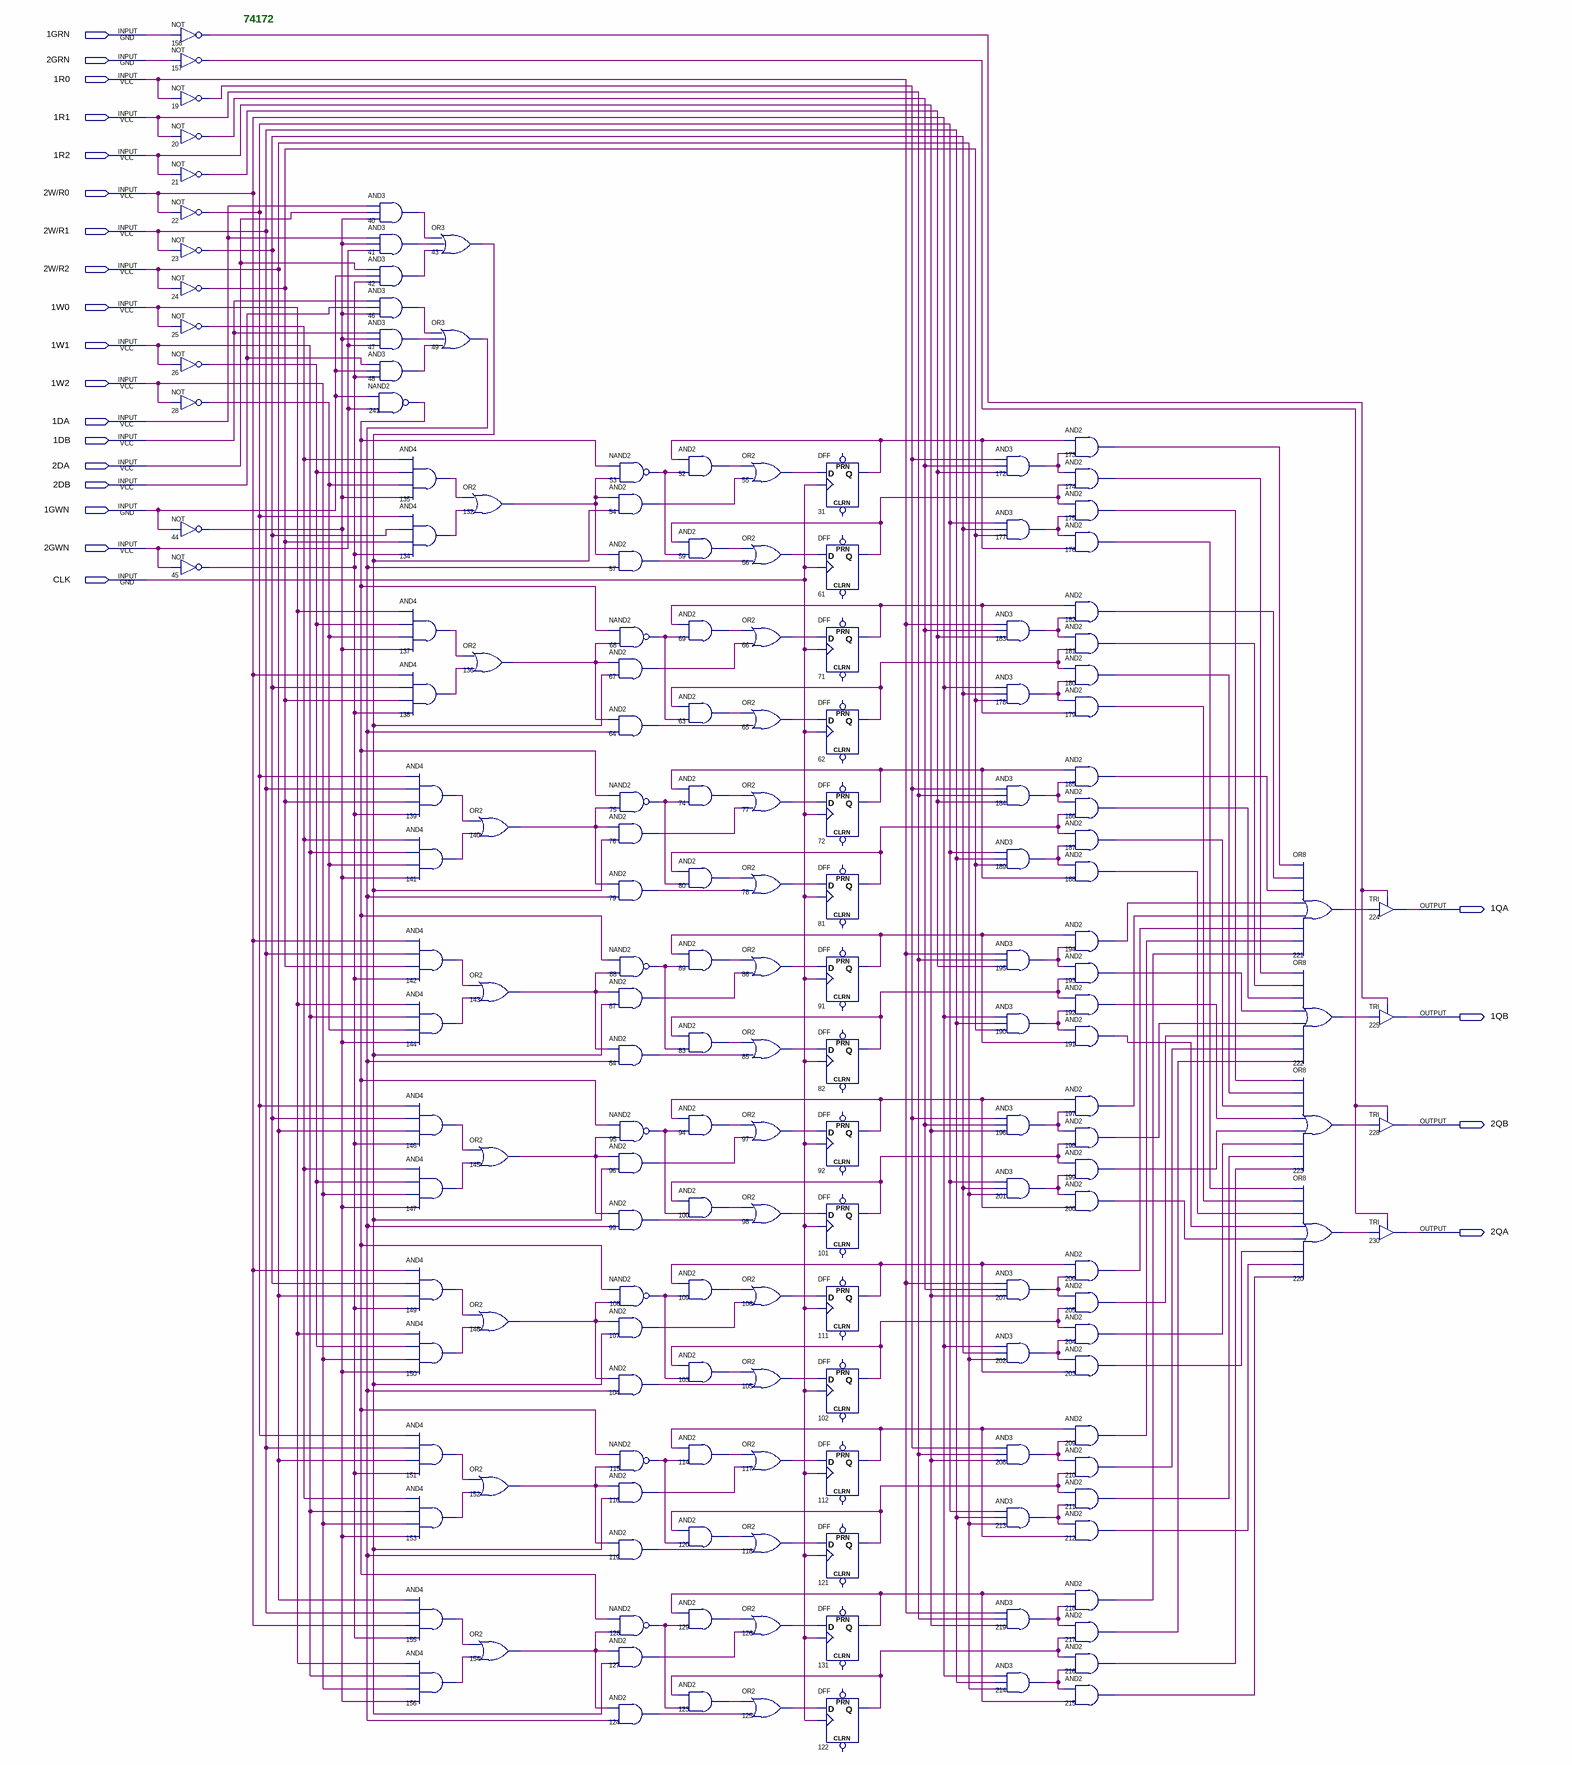
[diagram p0: schematic sheet]
// Quartus schematic 74172.bdf as structural Verilog: 174 symbols, 22 pins
module \74172  (
  input  \1GRN ,
  input  \2GRN ,
  input  \1R0 ,
  input  \1R1 ,
  input  \1R2 ,
  input  \2W/R0 ,
  input  \2W/R1 ,
  input  \2W/R2 ,
  input  \1W0 ,
  input  \1W1 ,
  input  \1W2 ,
  input  \1DA ,
  input  \1DB ,
  input  \2DA ,
  input  \2DB ,
  input  \1GWN ,
  input  \2GWN ,
  input  CLK,
  output \1QA ,
  output \1QB ,
  output \2QB ,
  output \2QA 
);

  wire n19_out, n20_out, n21_out, n22_out, n23_out, n24_out, n25_out, n26_out, n28_out, n31_q, n40_out,
       n41_out, n42_out, n43_out, n44_out, n45_out, n46_out, n47_out, n48_out, n49_out, n52_out, n53_out,
       n54_out, n55_out, n56_out, n57_out, n59_out, n61_q, n62_q, n63_out, n64_out, n65_out, n66_out,
       n67_out, n68_out, n69_out, n71_q, n72_q, n74_out, n75_out, n76_out, n77_out, n78_out, n79_out,
       n80_out, n81_q, n82_q, n83_out, n84_out, n85_out, n86_out, n87_out, n88_out, n89_out, n91_q, n92_q,
       n94_out, n95_out, n96_out, n97_out, n98_out, n99_out, n100_out, n101_q, n102_q, n103_out, n104_out,
       n105_out, n106_out, n107_out, n108_out, n109_out, n111_q, n112_q, n114_out, n115_out, n116_out,
       n117_out, n118_out, n119_out, n120_out, n121_q, n122_q, n123_out, n124_out, n125_out, n126_out,
       n127_out, n128_out, n129_out, n131_q, n132_out, n134_out, n135_out, n136_out, n137_out, n138_out,
       n139_out, n140_out, n141_out, n142_out, n143_out, n144_out, n145_out, n146_out, n147_out, n148_out,
       n149_out, n150_out, n151_out, n152_out, n153_out, n154_out, n155_out, n156_out, n157_out, n158_out,
       n172_out, n173_out, n174_out, n175_out, n176_out, n177_out, n178_out, n179_out, n180_out, n181_out,
       n182_out, n183_out, n184_out, n185_out, n186_out, n187_out, n188_out, n189_out, n190_out, n191_out,
       n192_out, n193_out, n194_out, n195_out, n196_out, n197_out, n198_out, n199_out, n200_out, n201_out,
       n202_out, n203_out, n204_out, n205_out, n206_out, n207_out, n208_out, n209_out, n210_out, n211_out,
       n212_out, n213_out, n214_out, n215_out, n216_out, n217_out, n218_out, n219_out, n220_out, n221_out,
       n222_out, n223_out, n241_out;

  not u_158 (n158_out, \1GRN );
  not u_157 (n157_out, \2GRN );
  not u_19 (n19_out, \1R0 );
  not u_20 (n20_out, \1R1 );
  not u_21 (n21_out, \1R2 );
  not u_22 (n22_out, \2W/R0 );
  not u_23 (n23_out, \2W/R1 );
  not u_24 (n24_out, \2W/R2 );
  not u_25 (n25_out, \1W0 );
  not u_26 (n26_out, \1W1 );
  not u_28 (n28_out, \1W2 );
  not u_44 (n44_out, \1GWN );
  not u_45 (n45_out, \2GWN );
  and u_40 (n40_out, \1DA , \2DA , n44_out);
  and u_41 (n41_out, \1DA , n44_out, \2GWN );
  and u_42 (n42_out, \2DA , \1GWN , n45_out);
  and u_46 (n46_out, \1DB , \2DB , n44_out);
  and u_47 (n47_out, \1DB , n44_out, \2GWN );
  and u_48 (n48_out, \2DB , \1GWN , n45_out);
  nand u_241 (n241_out, \1GWN , \2GWN );
  and u_135 (n135_out, n25_out, n26_out, n28_out, n44_out);
  and u_134 (n134_out, n22_out, n23_out, n24_out, n45_out);
  and u_137 (n137_out, \1W0 , n26_out, n28_out, n44_out);
  and u_138 (n138_out, \2W/R0 , n23_out, n24_out, n45_out);
  and u_139 (n139_out, n22_out, \2W/R1 , n24_out, n45_out);
  and u_141 (n141_out, n25_out, \1W1 , n28_out, n44_out);
  and u_142 (n142_out, \2W/R0 , \2W/R1 , n24_out, n45_out);
  and u_144 (n144_out, \1W0 , \1W1 , n28_out, n44_out);
  and u_146 (n146_out, n22_out, n23_out, \2W/R2 , n45_out);
  and u_147 (n147_out, n25_out, n26_out, \1W2 , n44_out);
  and u_149 (n149_out, \2W/R0 , n23_out, \2W/R2 , n45_out);
  and u_150 (n150_out, \1W0 , n26_out, \1W2 , n44_out);
  and u_151 (n151_out, n22_out, \2W/R1 , \2W/R2 , n45_out);
  and u_153 (n153_out, n25_out, \1W1 , \1W2 , n44_out);
  and u_155 (n155_out, \2W/R2 , \2W/R1 , \2W/R0 , n45_out);
  and u_156 (n156_out, \1W0 , \1W1 , \1W2 , n44_out);
  or u_43 (n43_out, n40_out, n41_out, n42_out);
  or u_49 (n49_out, n46_out, n47_out, n48_out);
  or u_132 (n132_out, n135_out, n134_out);
  or u_136 (n136_out, n137_out, n138_out);
  or u_140 (n140_out, n139_out, n141_out);
  or u_143 (n143_out, n142_out, n144_out);
  or u_145 (n145_out, n146_out, n147_out);
  or u_148 (n148_out, n149_out, n150_out);
  or u_152 (n152_out, n151_out, n153_out);
  or u_154 (n154_out, n155_out, n156_out);
  nand u_53 (n53_out, n241_out, n132_out);
  and u_54 (n54_out, n132_out, n43_out);
  and u_57 (n57_out, n132_out, n49_out);
  nand u_68 (n68_out, n241_out, n136_out);
  and u_67 (n67_out, n136_out, n43_out);
  and u_64 (n64_out, n136_out, n49_out);
  nand u_75 (n75_out, n241_out, n140_out);
  and u_76 (n76_out, n140_out, n43_out);
  and u_79 (n79_out, n140_out, n49_out);
  nand u_88 (n88_out, n241_out, n143_out);
  and u_87 (n87_out, n143_out, n43_out);
  and u_84 (n84_out, n143_out, n49_out);
  nand u_95 (n95_out, n241_out, n145_out);
  and u_96 (n96_out, n145_out, n43_out);
  and u_99 (n99_out, n145_out, n49_out);
  nand u_108 (n108_out, n241_out, n148_out);
  and u_107 (n107_out, n148_out, n43_out);
  and u_104 (n104_out, n148_out, n49_out);
  nand u_115 (n115_out, n241_out, n152_out);
  and u_116 (n116_out, n152_out, n43_out);
  and u_119 (n119_out, n152_out, n49_out);
  nand u_128 (n128_out, n241_out, n154_out);
  and u_127 (n127_out, n154_out, n43_out);
  and u_124 (n124_out, n154_out, n49_out);
  and u_52 (n52_out, n31_q, n53_out);
  and u_59 (n59_out, n61_q, n53_out);
  and u_69 (n69_out, n71_q, n68_out);
  and u_63 (n63_out, n62_q, n68_out);
  and u_74 (n74_out, n72_q, n75_out);
  and u_80 (n80_out, n81_q, n75_out);
  and u_89 (n89_out, n91_q, n88_out);
  and u_83 (n83_out, n82_q, n88_out);
  and u_94 (n94_out, n92_q, n95_out);
  and u_100 (n100_out, n101_q, n95_out);
  and u_109 (n109_out, n111_q, n108_out);
  and u_103 (n103_out, n102_q, n108_out);
  and u_114 (n114_out, n112_q, n115_out);
  and u_120 (n120_out, n121_q, n115_out);
  and u_129 (n129_out, n131_q, n128_out);
  and u_123 (n123_out, n122_q, n128_out);
  or u_55 (n55_out, n52_out, n54_out);
  or u_56 (n56_out, n59_out, n57_out);
  or u_66 (n66_out, n69_out, n67_out);
  or u_65 (n65_out, n63_out, n64_out);
  or u_77 (n77_out, n74_out, n76_out);
  or u_78 (n78_out, n80_out, n79_out);
  or u_86 (n86_out, n89_out, n87_out);
  or u_85 (n85_out, n83_out, n84_out);
  or u_97 (n97_out, n94_out, n96_out);
  or u_98 (n98_out, n100_out, n99_out);
  or u_106 (n106_out, n109_out, n107_out);
  or u_105 (n105_out, n103_out, n104_out);
  or u_117 (n117_out, n114_out, n116_out);
  or u_118 (n118_out, n120_out, n119_out);
  or u_126 (n126_out, n129_out, n127_out);
  or u_125 (n125_out, n123_out, n124_out);
  DFF u_31 (.CLK(CLK), .D(n55_out), .Q(n31_q));  // open: CLRN, PRN
  DFF u_61 (.CLK(CLK), .D(n56_out), .Q(n61_q));  // open: CLRN, PRN
  DFF u_71 (.CLK(CLK), .D(n66_out), .Q(n71_q));  // open: CLRN, PRN
  DFF u_62 (.CLK(CLK), .D(n65_out), .Q(n62_q));  // open: CLRN, PRN
  DFF u_72 (.CLK(CLK), .D(n77_out), .Q(n72_q));  // open: CLRN, PRN
  DFF u_81 (.CLK(CLK), .D(n78_out), .Q(n81_q));  // open: CLRN, PRN
  DFF u_91 (.CLK(CLK), .D(n86_out), .Q(n91_q));  // open: CLRN, PRN
  DFF u_82 (.CLK(CLK), .D(n85_out), .Q(n82_q));  // open: CLRN, PRN
  DFF u_92 (.CLK(CLK), .D(n97_out), .Q(n92_q));  // open: CLRN, PRN
  DFF u_101 (.CLK(CLK), .D(n98_out), .Q(n101_q));  // open: CLRN, PRN
  DFF u_111 (.CLK(CLK), .D(n106_out), .Q(n111_q));  // open: CLRN, PRN
  DFF u_102 (.CLK(CLK), .D(n105_out), .Q(n102_q));  // open: CLRN, PRN
  DFF u_112 (.CLK(CLK), .D(n117_out), .Q(n112_q));  // open: CLRN, PRN
  DFF u_121 (.CLK(CLK), .D(n118_out), .Q(n121_q));  // open: CLRN, PRN
  DFF u_131 (.CLK(CLK), .D(n126_out), .Q(n131_q));  // open: CLRN, PRN
  DFF u_122 (.CLK(CLK), .D(n125_out), .Q(n122_q));  // open: CLRN, PRN
  and u_172 (n172_out, n19_out, n20_out, n21_out);
  and u_177 (n177_out, n22_out, n23_out, n24_out);
  and u_183 (n183_out, \1R0 , n20_out, n21_out);
  and u_178 (n178_out, \2W/R0 , n23_out, n24_out);
  and u_184 (n184_out, n19_out, \1R1 , n21_out);
  and u_189 (n189_out, n22_out, \2W/R1 , n24_out);
  and u_195 (n195_out, \1R0 , \1R1 , n21_out);
  and u_190 (n190_out, \2W/R0 , \2W/R1 , n24_out);
  and u_196 (n196_out, n19_out, n20_out, \1R2 );
  and u_201 (n201_out, n22_out, n23_out, \2W/R2 );
  and u_207 (n207_out, \1R0 , n20_out, \1R2 );
  and u_202 (n202_out, \2W/R0 , n23_out, \2W/R2 );
  and u_208 (n208_out, n19_out, \1R1 , \1R2 );
  and u_213 (n213_out, n22_out, \2W/R1 , \2W/R2 );
  and u_219 (n219_out, \1R0 , \1R1 , \1R2 );
  and u_214 (n214_out, \2W/R0 , \2W/R1 , \2W/R2 );
  and u_173 (n173_out, n31_q, n172_out);
  and u_174 (n174_out, n172_out, n61_q);
  and u_175 (n175_out, n61_q, n177_out);
  and u_176 (n176_out, n177_out, n31_q);
  and u_182 (n182_out, n71_q, n183_out);
  and u_181 (n181_out, n183_out, n62_q);
  and u_180 (n180_out, n62_q, n178_out);
  and u_179 (n179_out, n178_out, n71_q);
  and u_185 (n185_out, n72_q, n184_out);
  and u_186 (n186_out, n184_out, n81_q);
  and u_187 (n187_out, n81_q, n189_out);
  and u_188 (n188_out, n189_out, n72_q);
  and u_194 (n194_out, n91_q, n195_out);
  and u_193 (n193_out, n195_out, n82_q);
  and u_192 (n192_out, n82_q, n190_out);
  and u_191 (n191_out, n190_out, n91_q);
  and u_197 (n197_out, n92_q, n196_out);
  and u_198 (n198_out, n196_out, n101_q);
  and u_199 (n199_out, n101_q, n201_out);
  and u_200 (n200_out, n201_out, n92_q);
  and u_206 (n206_out, n111_q, n207_out);
  and u_205 (n205_out, n207_out, n102_q);
  and u_204 (n204_out, n102_q, n202_out);
  and u_203 (n203_out, n202_out, n111_q);
  and u_209 (n209_out, n112_q, n208_out);
  and u_210 (n210_out, n208_out, n121_q);
  and u_211 (n211_out, n121_q, n213_out);
  and u_212 (n212_out, n213_out, n112_q);
  and u_218 (n218_out, n131_q, n219_out);
  and u_217 (n217_out, n219_out, n122_q);
  and u_216 (n216_out, n122_q, n214_out);
  and u_215 (n215_out, n214_out, n131_q);
  or u_221 (n221_out, n173_out, n182_out, n185_out, n194_out, n197_out, n206_out, n209_out, n218_out);
  or u_222 (n222_out, n174_out, n181_out, n186_out, n193_out, n198_out, n205_out, n210_out, n217_out);
  or u_223 (n223_out, n175_out, n180_out, n187_out, n192_out, n199_out, n204_out, n211_out, n216_out);
  or u_220 (n220_out, n176_out, n179_out, n188_out, n191_out, n200_out, n203_out, n212_out, n215_out);
  TRI u_224 (.IN(n221_out), .OE(n158_out), .OUT(\1QA ));
  TRI u_225 (.IN(n222_out), .OE(n158_out), .OUT(\1QB ));
  TRI u_228 (.IN(n223_out), .OE(n157_out), .OUT(\2QB ));
  TRI u_230 (.IN(n220_out), .OE(n157_out), .OUT(\2QA ));

  // Notes on the sheet:
  //   74172
endmodule
